# Altium schematic sheet BLOCKDIAGRAM.SchDoc: BLOCK DIAGRAM TRAM GIAM SAT NN
size A4; Author: PHAN SANG; SheetNumber: 2; SheetTotal: 2
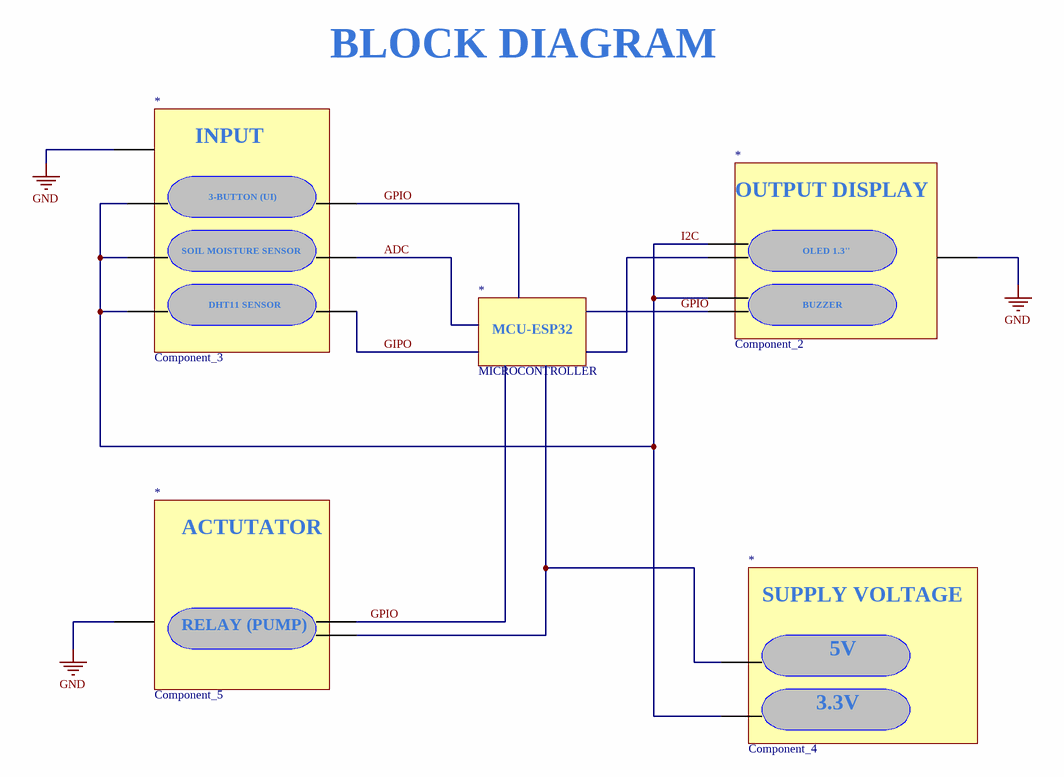
[diagram p0: BLOCKDIAGRAM.SchDoc]

## Parts
(Parts that share a designator on the sheet are numbered #1, #2 ... from top to bottom, then left to right.)
*#1  Component_3
*#2  Component_2
*#3  MICROCONTROLLER
*#4  Component_5
*#5  Component_4

## Nets
GND: *#1.99 *#2.101 *#4.101
ADC: *#1.104
GIPO: *#1.105
GPIO: *#1.103 *#2.101 *#4.100
I2C: *#1.100 *#1.101 *#1.102 *#2.101 *#5.101
Net*#4_101: *#4.101 *#5.100

Not connected (* = marked no-connect by the designer): *#2 100

## Notes on the sheet
- BLOCK DIAGRAM
- Title
- Size:
- Date:
- Author:
- A4
- Time:
- Number:
- Checked:
- Revision:
- Sheet
- Approved:
- of
- File:
- (in symbol Component_1) MCU-ESP32
- (in symbol Component_2) OUTPUT DISPLAY; OLED 1.3''; BUZZER
- (in symbol Component_3) INPUT; 3-BUTTON (UI); SOIL MOISTURE SENSOR; DHT11 SENSOR
- (in symbol Component_4) SUPPLY VOLTAGE; 5V; 3.3V
- (in symbol Component_5) ACTUTATOR; RELAY (PUMP)

## Library data of the parts
*#3 = Component_1